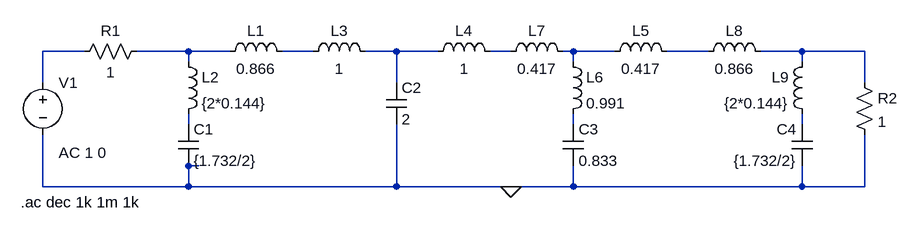
[diagram p0: schematic ej5.asc]
ej5.asc, the LTspice schematic file:
Version 4
SHEET 1 1272 680
WIRE 16 96 -48 96
WIRE 176 96 96 96
WIRE 240 96 176 96
WIRE 368 96 320 96
WIRE 496 96 448 96
WIRE 560 96 496 96
WIRE 672 96 640 96
WIRE 768 96 752 96
WIRE 832 96 768 96
WIRE 976 96 912 96
WIRE 1120 96 1056 96
WIRE 1216 96 1120 96
WIRE 176 112 176 96
WIRE 768 112 768 96
WIRE 1120 112 1120 96
WIRE -48 144 -48 96
WIRE 496 144 496 96
WIRE 1216 144 1216 96
WIRE 176 208 176 192
WIRE 768 208 768 192
WIRE 1120 208 1120 192
WIRE 192 272 176 272
WIRE -48 304 -48 224
WIRE 176 304 176 272
WIRE 176 304 -48 304
WIRE 496 304 496 208
WIRE 496 304 176 304
WIRE 672 304 496 304
WIRE 768 304 768 272
WIRE 768 304 672 304
WIRE 1120 304 1120 272
WIRE 1120 304 768 304
WIRE 1216 304 1216 224
WIRE 1216 304 1120 304
FLAG 672 304 0
SYMBOL voltage -48 128 R0
WINDOW 123 24 124 Left 2
WINDOW 39 0 0 Left 0
SYMATTR InstName V1
SYMATTR Value ""
SYMATTR Value2 AC 1 0
SYMBOL res 0 112 R270
WINDOW 0 32 56 VTop 2
WINDOW 3 0 56 VBottom 2
SYMATTR InstName R1
SYMATTR Value 1
SYMBOL ind 224 112 R270
WINDOW 0 32 56 VTop 2
WINDOW 3 5 56 VBottom 2
SYMATTR InstName L1
SYMATTR Value 0.866
SYMBOL ind 160 96 R0
SYMATTR InstName L2
SYMATTR Value {2*0.144}
SYMBOL cap 160 208 R0
SYMATTR InstName C1
SYMATTR Value {1.732/2}
SYMBOL ind 352 112 R270
WINDOW 0 32 56 VTop 2
WINDOW 3 5 56 VBottom 2
SYMATTR InstName L3
SYMATTR Value 1
SYMBOL cap 480 144 R0
SYMATTR InstName C2
SYMATTR Value 2
SYMBOL ind 544 112 R270
WINDOW 0 32 56 VTop 2
WINDOW 3 5 56 VBottom 2
SYMATTR InstName L4
SYMATTR Value 1
SYMBOL ind 816 112 R270
WINDOW 0 32 56 VTop 2
WINDOW 3 5 56 VBottom 2
SYMATTR InstName L5
SYMATTR Value 0.417
SYMBOL ind 752 96 R0
SYMATTR InstName L6
SYMATTR Value 0.991
SYMBOL cap 752 208 R0
SYMATTR InstName C3
SYMATTR Value 0.833
SYMBOL ind 656 112 R270
WINDOW 0 32 56 VTop 2
WINDOW 3 5 56 VBottom 2
SYMATTR InstName L7
SYMATTR Value 0.417
SYMBOL ind 1072 112 M270
WINDOW 0 32 56 VTop 2
WINDOW 3 5 56 VBottom 2
SYMATTR InstName L8
SYMATTR Value 0.866
SYMBOL ind 1136 96 M0
SYMATTR InstName L9
SYMATTR Value {2*0.144}
SYMBOL cap 1136 208 M0
SYMATTR InstName C4
SYMATTR Value {1.732/2}
SYMBOL res 1200 128 R0
SYMATTR InstName R2
SYMATTR Value 1
TEXT -82 328 Left 2 !.ac dec 1k 1m 1k

The netlist it stands for:
* ej5.asc
V1 N001 0 AC 1 0
R1 N001 N002 1
L1 N002 N003 0.866
L2 N002 N009 {2*0.144}
C1 N009 0 {1.732/2}
L3 N003 N004 1
C2 N004 0 2
L4 N004 N005 1
L5 N006 N007 0.417
L6 N006 N010 0.991
C3 N010 0 0.833
L7 N005 N006 0.417
L8 N008 N007 0.866
L9 N008 N011 {2*0.144}
C4 N011 0 {1.732/2}
R2 N008 0 1
.ac dec 1k 1m 1k
.backanno
.end